# Altium schematic sheet [7] RK3399_MIPI-CSI_I2C.SchDoc: RK3399, MIPI-CSI and I2C
size B; DocumentNumber: I; Revision: 01; SheetNumber: 7; SheetTotal: 19
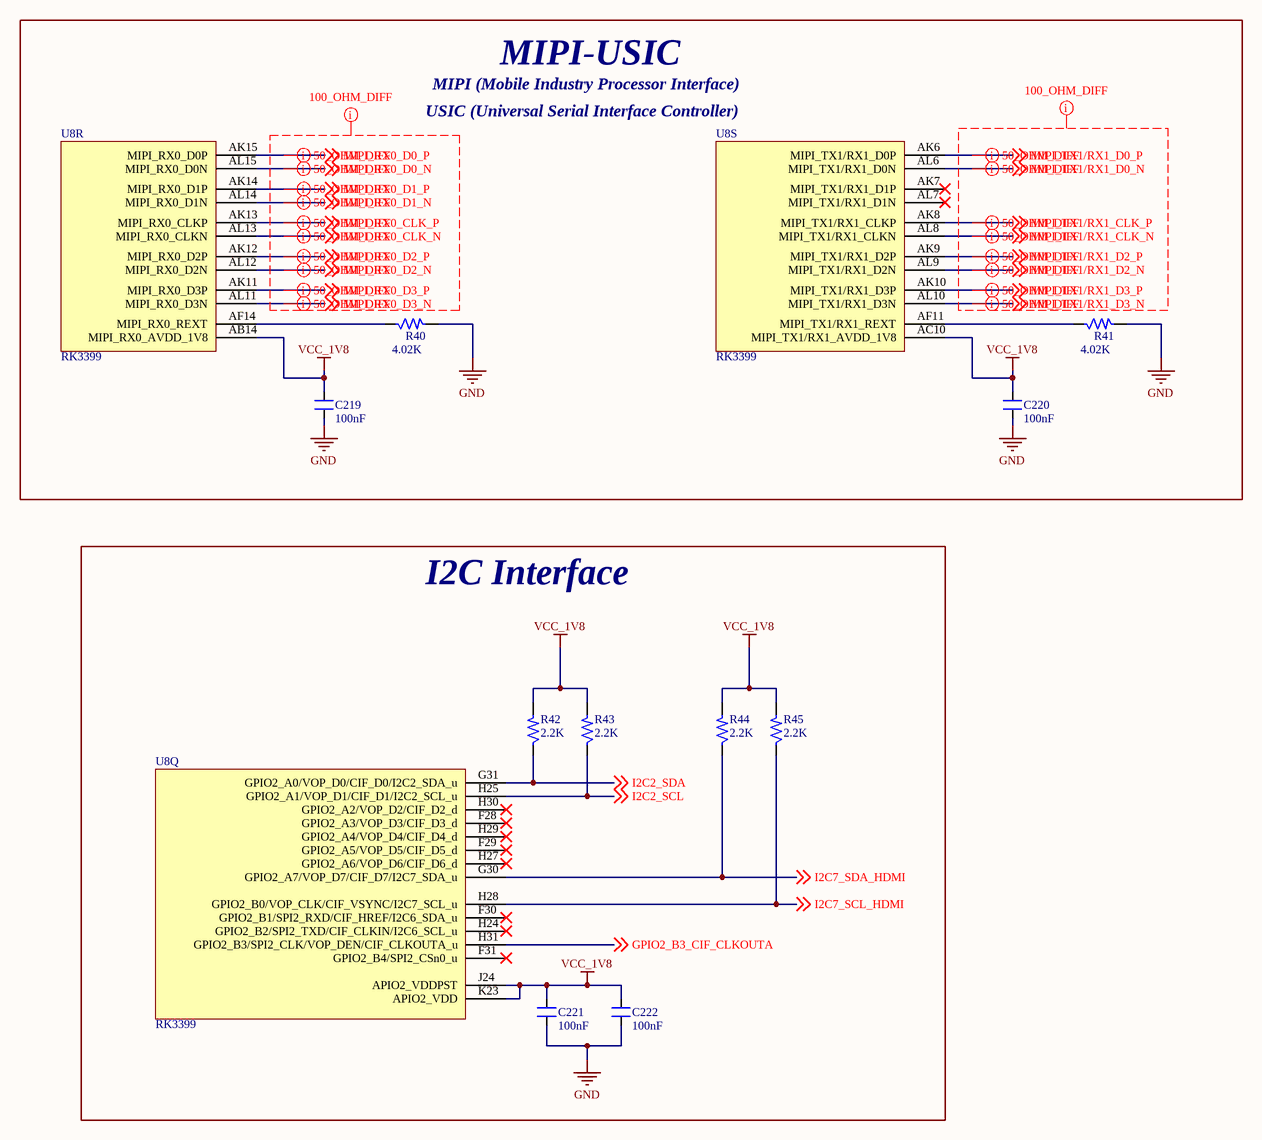
[diagram p0: [7] RK3399_MIPI-CSI_I2C.SchDoc]

## Parts
C219  100nF  [CAP_0201]
C220  100nF  [CAP_0201]
C221  100nF  [CAP_0201]
C222  100nF  [CAP_0201]
R40  4.02K  [RES_0201]
R41  4.02K  [RES_0201]
R42  2.2K  [RES_0201]
R43  2.2K  [RES_0201]
R44  2.2K  [RES_0201]
R45  2.2K  [RES_0201]
U8  RK3399  [FBGA828_23_826X826]  (parts Q,R,S of 24)

## Blocks framed on the sheet
MIPI-USIC: C219 C220 R40 R41 U8
I2C Interface: C221 C222 R42-R45 U8

## Nets
GND: C219.1 C220.1 C221.1 C222.1 R40.2 R41.2
VCC_1V8: C219.2 C220.2 C221.2 C222.2 R42.2 R43.2 R44.2 R45.2 U8.AB14(MIPI_RX0_AVDD_1V8) U8.AC10(MIPI_TX1/RX1_AVDD_1V8) U8.J24(APIO2_VDDPST) U8.K23(APIO2_VDD)
GPIO2_B3_CIF_CLKOUTA: U8.H31(GPIO2_B3/SPI2_CLK/VOP_DEN/CIF_CLKOUTA_u) ; off-sheet GPIO2_B3_CIF_CLKOUTA
I2C2_SCL: R43.1 U8.H25(GPIO2_A1/VOP_D1/CIF_D1/I2C2_SCL_u) ; off-sheet I2C2_SCL
I2C2_SDA: R42.1 U8.G31(GPIO2_A0/VOP_D0/CIF_D0/I2C2_SDA_u) ; off-sheet I2C2_SDA
I2C7_SCL_HDMI: R45.1 U8.H28(GPIO2_B0/VOP_CLK/CIF_VSYNC/I2C7_SCL_u) ; off-sheet I2C7_SCL_HDMI
I2C7_SDA_HDMI: R44.1 U8.G30(GPIO2_A7/VOP_D7/CIF_D7/I2C7_SDA_u) ; off-sheet I2C7_SDA_HDMI
MIPI_RX0_CLK_N: U8.AL13(MIPI_RX0_CLKN) ; off-sheet MIPI_RX0_CLK_N
MIPI_RX0_CLK_P: U8.AK13(MIPI_RX0_CLKP) ; off-sheet MIPI_RX0_CLK_P
MIPI_RX0_D0_N: U8.AL15(MIPI_RX0_D0N) ; off-sheet MIPI_RX0_D0_N
MIPI_RX0_D0_P: U8.AK15(MIPI_RX0_D0P) ; off-sheet MIPI_RX0_D0_P
MIPI_RX0_D1_N: U8.AL14(MIPI_RX0_D1N) ; off-sheet MIPI_RX0_D1_N
MIPI_RX0_D1_P: U8.AK14(MIPI_RX0_D1P) ; off-sheet MIPI_RX0_D1_P
MIPI_RX0_D2_N: U8.AL12(MIPI_RX0_D2N) ; off-sheet MIPI_RX0_D2_N
MIPI_RX0_D2_P: U8.AK12(MIPI_RX0_D2P) ; off-sheet MIPI_RX0_D2_P
MIPI_RX0_D3_N: U8.AL11(MIPI_RX0_D3N) ; off-sheet MIPI_RX0_D3_N
MIPI_RX0_D3_P: U8.AK11(MIPI_RX0_D3P) ; off-sheet MIPI_RX0_D3_P
MIPI_TX1/RX1_CLK_N: U8.AL8(MIPI_TX1/RX1_CLKN) ; off-sheet MIPI_TX1/RX1_CLK_N
MIPI_TX1/RX1_CLK_P: U8.AK8(MIPI_TX1/RX1_CLKP) ; off-sheet MIPI_TX1/RX1_CLK_P
MIPI_TX1/RX1_D0_N: U8.AL6(MIPI_TX1/RX1_D0N) ; off-sheet MIPI_TX1/RX1_D0_N
MIPI_TX1/RX1_D0_P: U8.AK6(MIPI_TX1/RX1_D0P) ; off-sheet MIPI_TX1/RX1_D0_P
MIPI_TX1/RX1_D2_N: U8.AL9(MIPI_TX1/RX1_D2N) ; off-sheet MIPI_TX1/RX1_D2_N
MIPI_TX1/RX1_D2_P: U8.AK9(MIPI_TX1/RX1_D2P) ; off-sheet MIPI_TX1/RX1_D2_P
MIPI_TX1/RX1_D3_N: U8.AL10(MIPI_TX1/RX1_D3N) ; off-sheet MIPI_TX1/RX1_D3_N
MIPI_TX1/RX1_D3_P: U8.AK10(MIPI_TX1/RX1_D3P) ; off-sheet MIPI_TX1/RX1_D3_P
NetR40_1: R40.1 U8.AF14(MIPI_RX0_REXT)
NetR41_1: R41.1 U8.AF11(MIPI_TX1/RX1_REXT)

Not connected (* = marked no-connect by the designer): U8 AK7(MIPI_TX1/RX1_D1P)* AL7(MIPI_TX1/RX1_D1N)* F28(GPIO2_A3/VOP_D3/CIF_D3_d)* F29(GPIO2_A5/VOP_D5/CIF_D5_d)* F30(GPIO2_B1/SPI2_RXD/CIF_HREF/I2C6_SDA_u)* F31(GPIO2_B4/SPI2_CSn0_u)* H24(GPIO2_B2/SPI2_TXD/CIF_CLKIN/I2C6_SCL_u)* H27(GPIO2_A6/VOP_D6/CIF_D6_d)* H29(GPIO2_A4/VOP_D4/CIF_D4_d)* H30(GPIO2_A2/VOP_D2/CIF_D2_d)*

## Layout directives
differential pair; differential pair class 100_OHM_DIFF: MIPI_RX0_CLK_N, MIPI_RX0_CLK_P, MIPI_RX0_D0_N, MIPI_RX0_D0_P, MIPI_RX0_D1_N, MIPI_RX0_D1_P, MIPI_RX0_D2_N, MIPI_RX0_D2_P, MIPI_RX0_D3_N, MIPI_RX0_D3_P, MIPI_TX1/RX1_CLK_N, MIPI_TX1/RX1_CLK_P, MIPI_TX1/RX1_D0_N, MIPI_TX1/RX1_D0_P, MIPI_TX1/RX1_D2_N, MIPI_TX1/RX1_D2_P, MIPI_TX1/RX1_D3_N, MIPI_TX1/RX1_D3_P
mark named 100_OHM_DIFF: MIPI_RX0_CLK_N, MIPI_RX0_CLK_P, MIPI_RX0_D0_N, MIPI_RX0_D0_P, MIPI_RX0_D1_N, MIPI_RX0_D1_P, MIPI_RX0_D2_N, MIPI_RX0_D2_P, MIPI_RX0_D3_N, MIPI_RX0_D3_P, MIPI_TX1/RX1_CLK_N, MIPI_TX1/RX1_CLK_P, MIPI_TX1/RX1_D0_N, MIPI_TX1/RX1_D0_P, MIPI_TX1/RX1_D2_N, MIPI_TX1/RX1_D2_P, MIPI_TX1/RX1_D3_N, MIPI_TX1/RX1_D3_P

## Notes on the sheet
- MIPI (Mobile Industry Processor Interface)
- USIC (Universal Serial Interface Controller)
- Title
- Size:
- Date:
- B
- Number:
- Time:
- Revision:
- Sheet
- of
- File:

## Library data of the parts
C219-C222 = CAP_100nF-25V-10%-0201: 0.1µF ±10% 25V Ceramic Capacitor X5R 0201 (0603 Metric) /; Manufacturer: TDK Corporation; Manufacturer Part Number: C0603X5R1E104K030BB; Case/Package: 0201; Supplier-1: Digikey
R40 R41 = RES_4.02K-0.05W-1%-0201: 4.02 kOhms ±1% 0.05W, 1/20W Chip Resistor 0201 (0603 Metric) Thick Film /; Manufacturer: Yageo; Manufacturer Part Number: RC0201FR-074K02L; Case/Package: 0201; Supplier-1: Digikey
R42-R45 = RES_2.2K-0.05W-1%-0201: 2.2 kOhms ±1% 0.05W, 1/20W Chip Resistor 0201 (0603 Metric) Thick Film /; Manufacturer: Stackpole Electronics Inc; Manufacturer Part Number: RMCF0201FT2K20; Case/Package: 0201; Supplier-1: Digikey
U8 = IC_RK3399-FCBGA828: RK3399 is a low power, high performance processor for computing, personal mobile.; Manufacturer: Rockchip; Manufacturer Part Number: RK3399; Case/Package: FCBGA828; Supplier-1: Rockchip